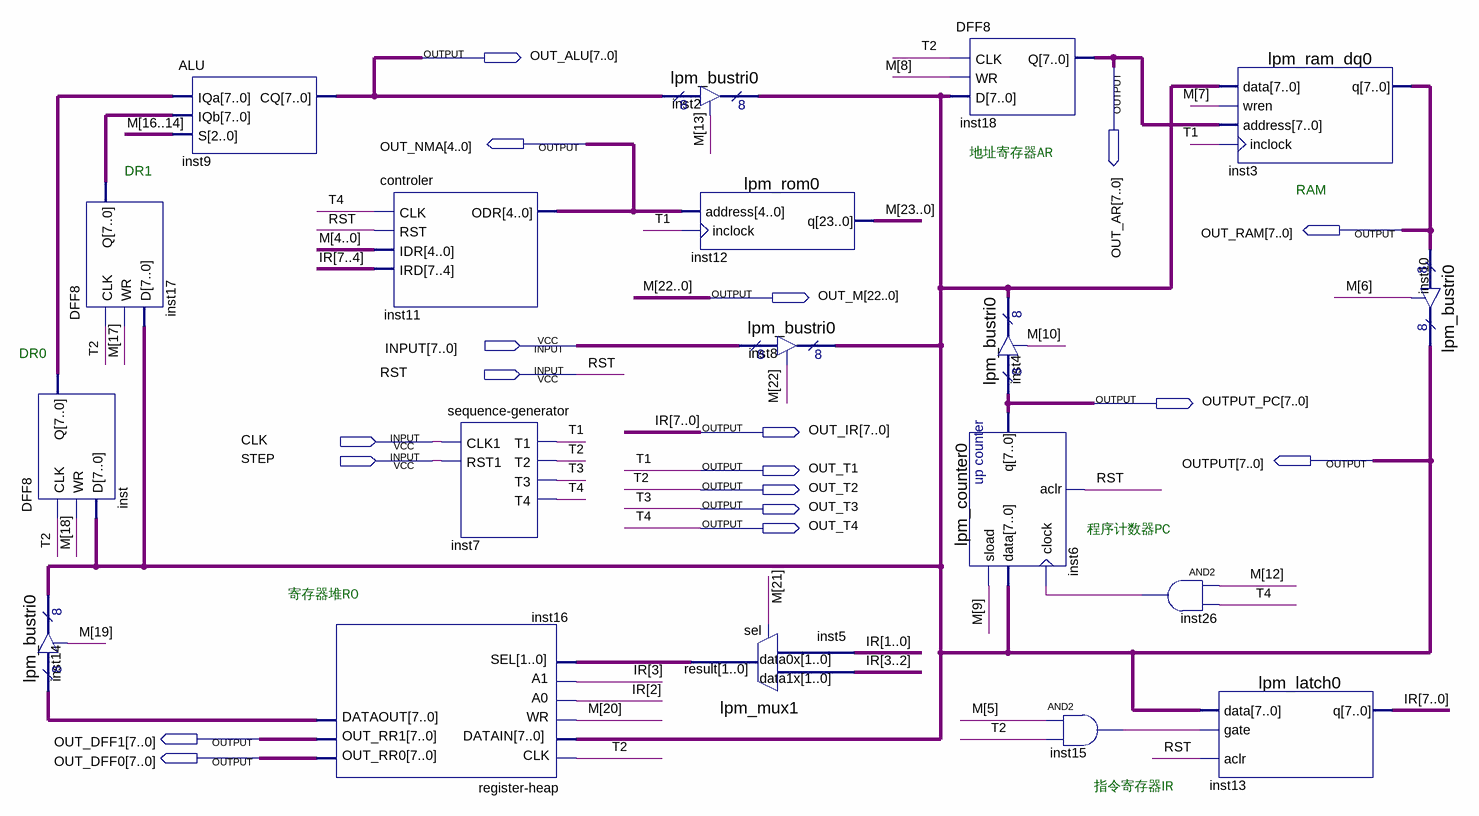
[diagram p0: schematic sheet]
// Quartus schematic cpu_copy.bdf as structural Verilog: 19 symbols, 18 pins
module cpu_copy (
  input  [7:0] INPUT,
  input  RST,
  input  CLK,
  input  STEP,
  output [7:0] OUT_ALU,
  output [7:0] OUT_AR,
  output [4:0] OUT_NMA,
  output [7:0] OUT_RAM,
  output [22:0] OUT_M,
  output [7:0] OUTPUT_PC,
  output [7:0] OUT_IR,
  output [7:0] OUTPUT,
  output OUT_T1,
  output OUT_T2,
  output OUT_T3,
  output OUT_T4,
  output [7:0] OUT_DFF1,
  output [7:0] OUT_DFF0
);

  wire inst15_out, inst26_out;
  wire [1:0] inst5_result;
  wire [7:0] inst16_dataout, inst17_q, inst_q;
  wire [23:23] M;

  DFF8 inst (.CLK(OUT_T2), .WR(OUT_M[18]), .D(OUTPUT), .Q(inst_q));
  lpm_bustri0 inst14 (.enabledt(OUT_M[19]), .data(inst16_dataout), .tridata(OUTPUT));
  DFF8 inst17 (.CLK(OUT_T2), .WR(OUT_M[17]), .D(OUTPUT), .Q(inst17_q));
  ALU inst9 (.IQa(inst_q), .IQb(inst17_q), .S(OUT_M[16:14]), .CQ(OUT_ALU));
  \register-heap  inst16 (
    .CLK(OUT_T2), .DATAIN(OUTPUT), .WR(OUT_M[20]), .A0(OUT_IR[2]), .A1(OUT_IR[3]), .SEL(inst5_result),
    .OUT_RR0(OUT_DFF0), .OUT_RR1(OUT_DFF1), .DATAOUT(inst16_dataout));
  controler inst11 (.CLK(OUT_T4), .RST(RST), .IDR(OUT_M[4:0]), .IRD(OUT_IR[7:4]), .ODR(OUT_NMA));
  \sequence-generator  inst7 (.CLK1(CLK), .RST1(STEP), .T1(OUT_T1), .T2(OUT_T2), .T3(OUT_T3), .T4(OUT_T4));
  lpm_bustri0 inst2 (.enabledt(OUT_M[13]), .data(OUT_ALU), .tridata(OUTPUT));
  lpm_rom0 inst12 (.address(OUT_NMA), .inclock(OUT_T1), .q({M[23], OUT_M}));
  lpm_bustri0 inst8 (.enabledt(OUT_M[22]), .data(INPUT), .tridata(OUTPUT));
  lpm_mux1 inst5 (.data1x(OUT_IR[3:2]), .data0x(OUT_IR[1:0]), .sel(OUT_M[21]), .result(inst5_result));
  DFF8 inst18 (.CLK(OUT_T2), .WR(OUT_M[8]), .D(OUTPUT), .Q(OUT_AR));
  lpm_bustri0 inst4 (.enabledt(OUT_M[10]), .data(OUTPUT_PC), .tridata(OUTPUT));
  lpm_counter0 inst6 (.sload(OUT_M[9]), .data(OUTPUT), .clock(inst26_out), .aclr(RST), .q(OUTPUT_PC));
  and inst15 (inst15_out, OUT_M[5], OUT_T2);
  and inst26 (inst26_out, OUT_M[12], OUT_T4);
  lpm_latch0 inst13 (.data(OUTPUT), .gate(inst15_out), .aclr(RST), .q(OUT_IR));
  lpm_ram_dq0 inst3 (.data(OUTPUT), .wren(OUT_M[7]), .address(OUT_AR), .inclock(OUT_T1), .q(OUT_RAM));
  lpm_bustri0 inst10 (.enabledt(OUT_M[6]), .data(OUT_RAM), .tridata(OUTPUT));

  // Other names for the same wires on the sheet: IR[7:0] = OUT_IR; M[22:0] = OUT_M; T1 = OUT_T1; T2 = OUT_T2;
  //   T3 = OUT_T3; T4 = OUT_T4

  // Notes on the sheet:
  //   地址寄存器AR
  //   DR1
  //   RAM
  //   DR0
  //   程序计数器PC
  //   寄存器堆R0
  //   指令寄存器IR
endmodule
